# EAGLE schematic keypad (EAGLE 7.3.0)
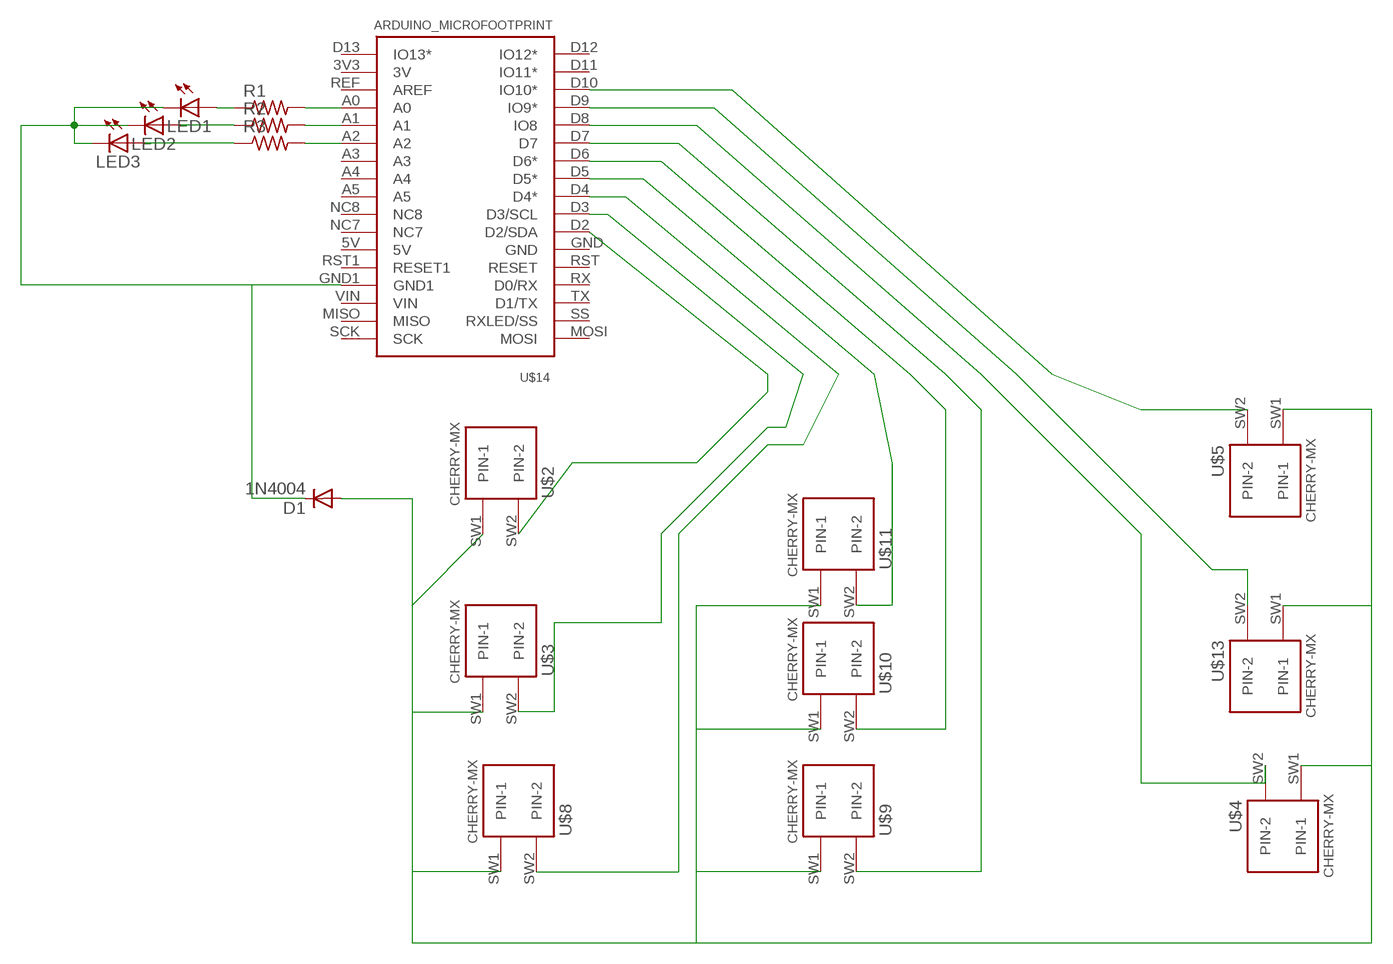
[diagram p0: schematic, sheet 1]

## Parts
D1  1N4004  [DO41-10]
LED1  LED5MM  [LED5MM]
LED2  LED5MM  [LED5MM]
LED3  LED5MM  [LED5MM]
R1  R-US_0207/5V  [0207/5V]
R2  R-US_0207/5V  [0207/5V]
R3  R-US_0207/5V  [0207/5V]
U$2  CHERRY-MX  [CHERRY-MX]
U$3  CHERRY-MX  [CHERRY-MX]
U$4  CHERRY-MX  [CHERRY-MX]
U$5  CHERRY-MX  [CHERRY-MX]
U$8  CHERRY-MX  [CHERRY-MX]
U$9  CHERRY-MX  [CHERRY-MX]
U$10  CHERRY-MX  [CHERRY-MX]
U$11  CHERRY-MX  [CHERRY-MX]
U$13  CHERRY-MX  [CHERRY-MX]
U$14  ARDUINO_MICROFOOTPRINT  [ARDUINO-MICRO]

## Nets
N$1: R1.2 U$14.A0
N$2: U$2.SW2(PIN-2) U$14.D2(D2/SDA)
N$3: U$3.SW2(PIN-2) U$14.D3(D3/SCL)
N$4: U$8.SW2(PIN-2) U$14.D4(D4*)
N$5: U$11.SW2(PIN-2) U$14.D5(D5*)
N$6: U$10.SW2(PIN-2) U$14.D6(D6*)
N$7: U$9.SW2(PIN-2) U$14.D7
N$8: U$4.SW2(PIN-2) U$14.D8(IO8)
N$9: U$13.SW2(PIN-2) U$14.D9(IO9*)
N$10: U$5.SW2(PIN-2) U$14.D10(IO10*)
N$13: R2.2 U$14.A1
N$14: R3.2 U$14.A2
N$15: LED1.A R1.1
N$16: LED2.A R2.1
N$17: LED3.A R3.1
N$18: D1.C LED1.K(C) LED2.K(C) LED3.K(C) U$14.GND1
N$19: D1.A U$2.SW1(PIN-1) U$3.SW1(PIN-1) U$4.SW1(PIN-1) U$5.SW1(PIN-1) U$8.SW1(PIN-1) U$9.SW1(PIN-1) U$10.SW1(PIN-1) U$11.SW1(PIN-1) U$13.SW1(PIN-1)
Unconnected: U$14.3V3(3V) U$14.5V U$14.A3 U$14.A4 U$14.A5 U$14.D11(IO11*) U$14.D12(IO12*) U$14.D13(IO13*) U$14.GND U$14.MISO U$14.MOSI U$14.NC7 U$14.NC8 U$14.REF(AREF) U$14.RST1(RESET1) U$14.RST(RESET) U$14.RX(D0/RX) U$14.SCK U$14.SS(RXLED/SS) U$14.TX(D1/TX) U$14.VIN

## Library data of the parts
D1 = diode:1N4004: DIODE general purpose rectifier, 1 A
LED1-LED3 = led:LED: LED OSRAM: - CHIPLED LG R971, LG N971, LY N971, LG Q971, LY Q971, LO R971, LY R971 LH N974, LH R974 LS Q976, LO Q976, LY Q976 LO Q996 - Hyper CHIPLED LW Q18S LB Q993, LB Q99A, LB R99A - SideLED LS A670, LO A670, LY A670, LG A670, LP A670 LB A673, LV A673, LT A673, LW A673 LH A674 LY A675 LS A676, LA A676, LO A676, LY A676, LW A676 LS A679, LY A679, LG A679 - Hyper Micro SIDELED® LS Y876, LA Y876, LO Y876, LY Y876 LT Y87S - SmartLED LW L88C, LW L88S LB L89C, LB L89S, LG L890 LS L89K, LO L89K, LY L89K LS L896, LA L896, LO L896, LY L896 - TOPLED LS T670, LO T670, LY T670, LG T670, LP T670 LSG T670, LSP T670, LSY T670, LOP T670, LYG T670 LG T671, LOG T671, LSG T671 LB T673, LV T673, LT T673, LW T673 LH T674 LS T676, LA T676, LO T676, LY T676, LB T676, LH T676, LSB T676, LW T676 LB T67C, LV T67C, LT T67C, LS T67K, LO T67K, LY T67K, LW E67C LS E67B, LA E67B, LO E67B, LY E67B, LB E67C, LV E67C, LT E67C LW T67C LS T679, LY T679, LG T679 LS T770, LO T770, LY T770, LG T770, LP T770 LB T773, LV T773, LT T773, LW T773 LH T774 LS E675, LA E675, LY E675, LS T675 LS T776, LA T776, LO T776, LY T776, LB T776 LHGB T686 LT T68C, LB T68C - Hyper Mini TOPLED® LB M676 - Mini TOPLED Santana® LG M470 LS M47K, LO M47K, LY M47K Source: http://www.osram.convergy.de LUXEON: - LUMILED® LXK2-PW12-R00, LXK2-PW12-S00, LXK2-PW14-U00, LXK2-PW14-V00 LXK2-PM12-R00, LXK2-PM12-S00, LXK2-PM14-U00 LXK2-PE12-Q00, LXK2-PE12-R00, LXK2-PE12-S00, LXK2-PE14-T00, LXK2-PE14-U00 LXK2-PB12-K00, LXK2-PB12-L00, LXK2-PB12-M00, LXK2-PB14-N00, LXK2-PB14-P00, LXK2-PB14-Q00 LXK2-PR12-L00, LXK2-PR12-M00, LXK2-PR14-Q00, LXK2-PR14-R00 LXK2-PD12-Q00, LXK2-PD12-R00, LXK2-PD12-S00 LXK2-PH12-R00, LXK2-PH12-S00 LXK2-PL12-P00, LXK2-PL12-Q00, LXK2-PL12-R00 Source: www.luxeon.com KINGBRIGHT: KA-3528ASYC Source: www.kingbright.com
R1-R3 = resistor:R-US_: RESISTOR, American symbol
U$2-U$5 U$8-U$11 U$13 = cherrymx:CHERRY-MX: Cherry MX series keyswitch
U$14 = arduino-micro:ARDUINO_MICRO